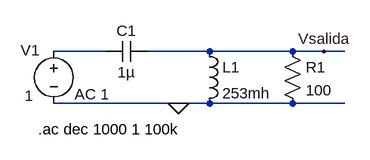
[diagram p0: schematic TP3 DASE pasa alto.asc]
TP3 DASE pasa alto.asc, the LTspice schematic file:
Version 4
SHEET 1 880 680
WIRE 80 80 0 80
WIRE 240 80 144 80
WIRE 368 80 240 80
WIRE 416 80 368 80
WIRE 448 80 416 80
WIRE 192 160 0 160
WIRE 240 160 192 160
WIRE 368 160 240 160
WIRE 448 160 368 160
FLAG 192 160 0
FLAG 416 80 Vsalida
SYMBOL ind 224 64 R0
SYMATTR InstName L1
SYMATTR Value 253mh
SYMBOL cap 144 64 R90
WINDOW 0 0 32 VBottom 2
WINDOW 3 32 32 VTop 2
SYMATTR InstName C1
SYMATTR Value 1µ
SYMBOL res 352 64 R0
SYMATTR InstName R1
SYMATTR Value 100
SYMBOL voltage 0 64 R0
WINDOW 0 -51 14 Left 2
WINDOW 3 -45 84 Left 2
WINDOW 123 32 82 Left 2
WINDOW 39 0 0 Left 0
SYMATTR InstName V1
SYMATTR Value 1
SYMATTR Value2 AC 1
TEXT -24 200 Left 2 !.ac dec 1000 1 100k

The netlist it stands for:
* TP3 DASE pasa alto.asc
L1 Vsalida 0 253mh
C1 Vsalida N001 1µ
R1 Vsalida 0 100
V1 N001 0 1 AC 1
.ac dec 1000 1 100k
.backanno
.end